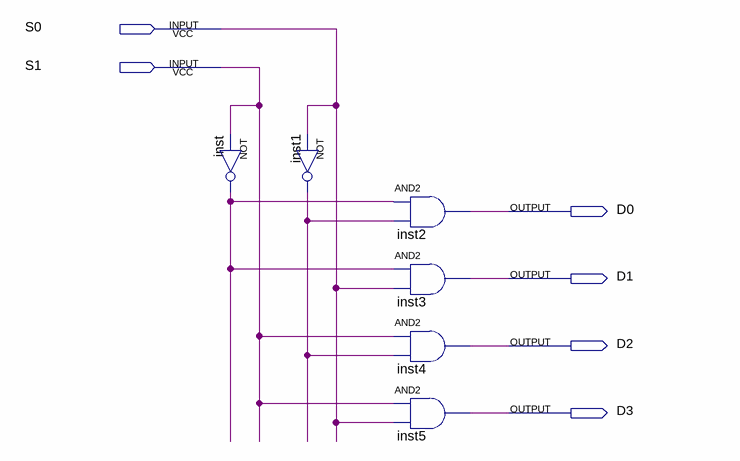
[diagram p0: schematic sheet]
// Quartus schematic decod2x4.bdf as structural Verilog: 6 symbols, 6 pins
module decod2x4 (
  input  S0,
  input  S1,
  output D0,
  output D1,
  output D2,
  output D3
);

  wire inst1_out, inst_out;

  not inst (inst_out, S1);
  not inst1 (inst1_out, S0);
  and inst2 (D0, inst_out, inst1_out);
  and inst3 (D1, inst_out, S0);
  and inst4 (D2, S1, inst1_out);
  and inst5 (D3, S1, S0);
endmodule
